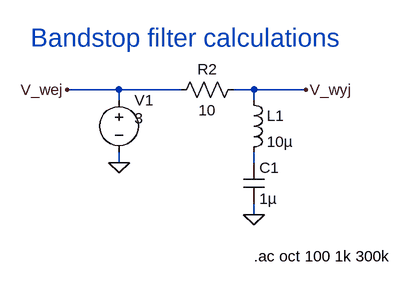
[diagram p0: schematic bandstop.asc]
bandstop.asc, the LTspice schematic file:
Version 4
SHEET 1 880 680
WIRE 80 48 0 48
WIRE 176 48 80 48
WIRE 288 48 256 48
WIRE 368 48 288 48
WIRE 80 64 80 48
WIRE 288 64 288 48
WIRE 80 160 80 144
WIRE 288 160 288 144
WIRE 288 240 288 224
FLAG 0 48 V_wej
FLAG 368 48 V_wyj
FLAG 80 160 0
FLAG 288 240 0
SYMBOL voltage 80 48 R0
WINDOW 3 24 44 Left 2
WINDOW 39 0 0 Left 0
SYMATTR Value 3
SYMATTR InstName V1
SYMATTR Value2 AC 1
SYMBOL res 272 32 R90
WINDOW 0 0 56 VBottom 2
WINDOW 3 32 56 VTop 2
SYMATTR InstName R2
SYMATTR Value 10
SYMBOL ind 272 48 R0
SYMATTR InstName L1
SYMATTR Value 10µ
SYMATTR SpiceLine Ipk=1.4 Rser=0.127 Rpar=16970 Cpar=1.698p mfg="Bourns, Inc." pn="SDE0403A-100M"
SYMBOL cap 272 160 R0
SYMATTR InstName C1
SYMATTR Value 1µ
SYMATTR SpiceLine V=16 Irms=0 Rser=0.00745135 Lser=304.087p mfg="Würth Elektronik" pn="885012106017 WCAP-CSGP 0603" type="X5R"
TEXT 288 304 Left 2 !.ac oct 100 1k 300k
TEXT -56 -32 Left 4 ;Bandstop filter calculations

The netlist it stands for:
* bandstop.asc
V1 V_wej 0 3 AC 1
R2 V_wyj V_wej 10
L1 V_wyj N001 10µ Ipk=1.4 Rser=0.127 Rpar=16970 Cpar=1.698p mfg="Bourns, Inc." pn="SDE0403A-100M"
C1 N001 0 1µ V=16 Irms=0 Rser=0.00745135 Lser=304.087p mfg="Würth Elektronik" pn="885012106017 WCAP-CSGP 0603" type="X5R"
.ac oct 100 1k 300k
* Bandstop filter calculations
.backanno
.end